# EAGLE design ESR_Harness (EAGLE 5.06)
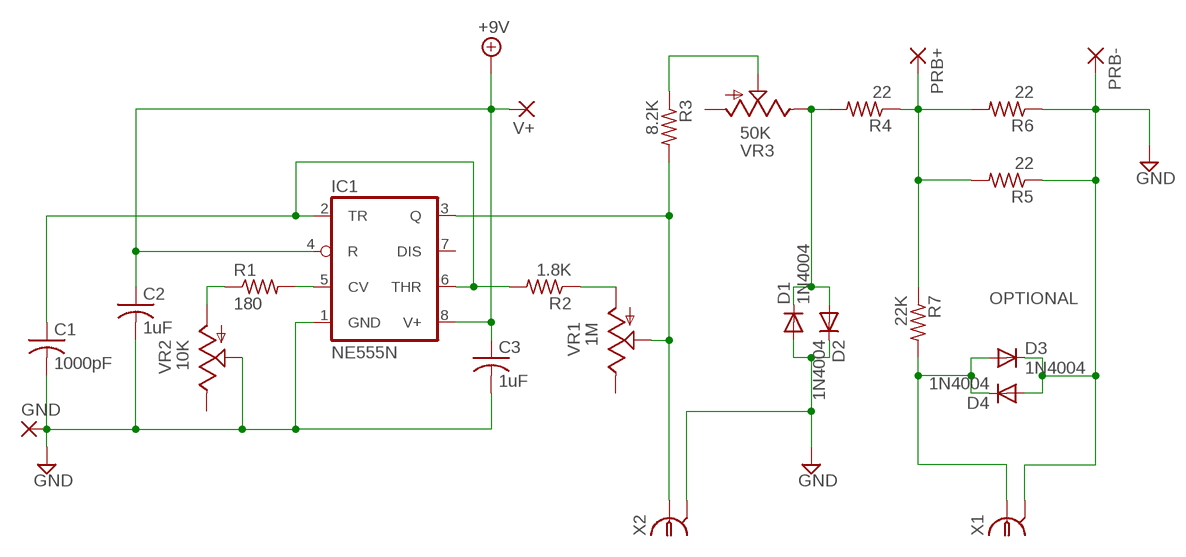
[diagram p0: schematic, sheet 1]

## Parts
C1  1000pF  C-US050-025X075  [C050-025X075]
C2  1uF  C-US050-025X075  [C050-025X075]
C3  1uF  C-US050-025X075  [C050-025X075]
D1  1N4004  [DO41-10]
D2  1N4004  [DO41-10]
D3  1N4004  [DO41-10]
D4  1N4004  [DO41-10]
GND  WIREPAD2,15/1,0  [2,15/1,0]
IC1  NE555N  [DIL08]
PRB+  WIREPAD3,17/1,3  [3,17/1,3]
PRB-  WIREPAD3,17/1,3  [3,17/1,3]
R1  180  R-US_0309/10  [0309/10]
R2  1.8K  R-US_0309/10  [0309/10]
R3  8.2K  R-US_0207/5V  [0207/5V]
R4  22  R-US_0309/12  [0309/12]
R5  22  R-US_0309/12  [0309/12]
R6  22  R-US_0309/12  [0309/12]
R7  22K  R-US_0309/12  [0309/12]
V+  WIREPAD2,15/1,0  [2,15/1,0]
VR1  1M  TRIM_US-  [OFFBOARD_POT_3]
VR2  10K  TRIM_US-  [OFFBOARD_POT_3]
VR3  50K  TRIM_US-  [OFFBOARD_POT_3]
X1  OFFBOARD_BNC  [OFFBOARD_COAX]
X2  OFFBOARD_BNC  [OFFBOARD_COAX]

## Nets
+9V: C2.1 C3.1 IC1.4(R) IC1.8(V+) V+.1(P)
GND: C1.2 C2.2 C3.2 D1.A D2.C D3.C D4.A GND.1(P) IC1.1(GND) PRB-.1(P) R5.1 R6.1 VR2.P$2(S) X1.P$GND(GND) X2.P$GND(GND)
N$1: C1.1 IC1.2(TR) IC1.6(THR) R2.2
N$2: IC1.5(CV) R1.2
N$4: IC1.3(Q) R3.2 VR1.P$2(S) X2.P$1
N$5: PRB+.1(P) R4.1 R5.2 R6.2 R7.1
N$6: R1.1 VR2.P$1(A)
N$7: D1.C D2.A R4.2 VR3.P$3(E)
N$8: R3.1 VR3.P$2(S)
N$9: D3.A D4.C R7.2 X1.P$1
N$10: R2.1 VR1.P$1(A)
Unconnected: IC1.7(DIS) VR1.P$3(E) VR2.P$3(E) VR3.P$1(A)

## Notes on the sheet
- OPTIONAL

## Library data of the parts
C1-C3 = rcl:C-US: CAPACITOR, American symbol
D1-D4 = diode:1N4004: DIODE general purpose rectifier, 1 A
GND PRB+ PRB- V+ = wirepad:WIREPAD: Wire PAD connect wire on PCB
IC1 = linear:*555: TIMER
R1-R7 = rcl:R-US_: RESISTOR, American symbol
VR1-VR3 = mes:TRIM_US-: POTENTIOMETER
X1 X2 = mes:OFFBOARD_BNC: JACK, 50 OHM, BNC

## Board
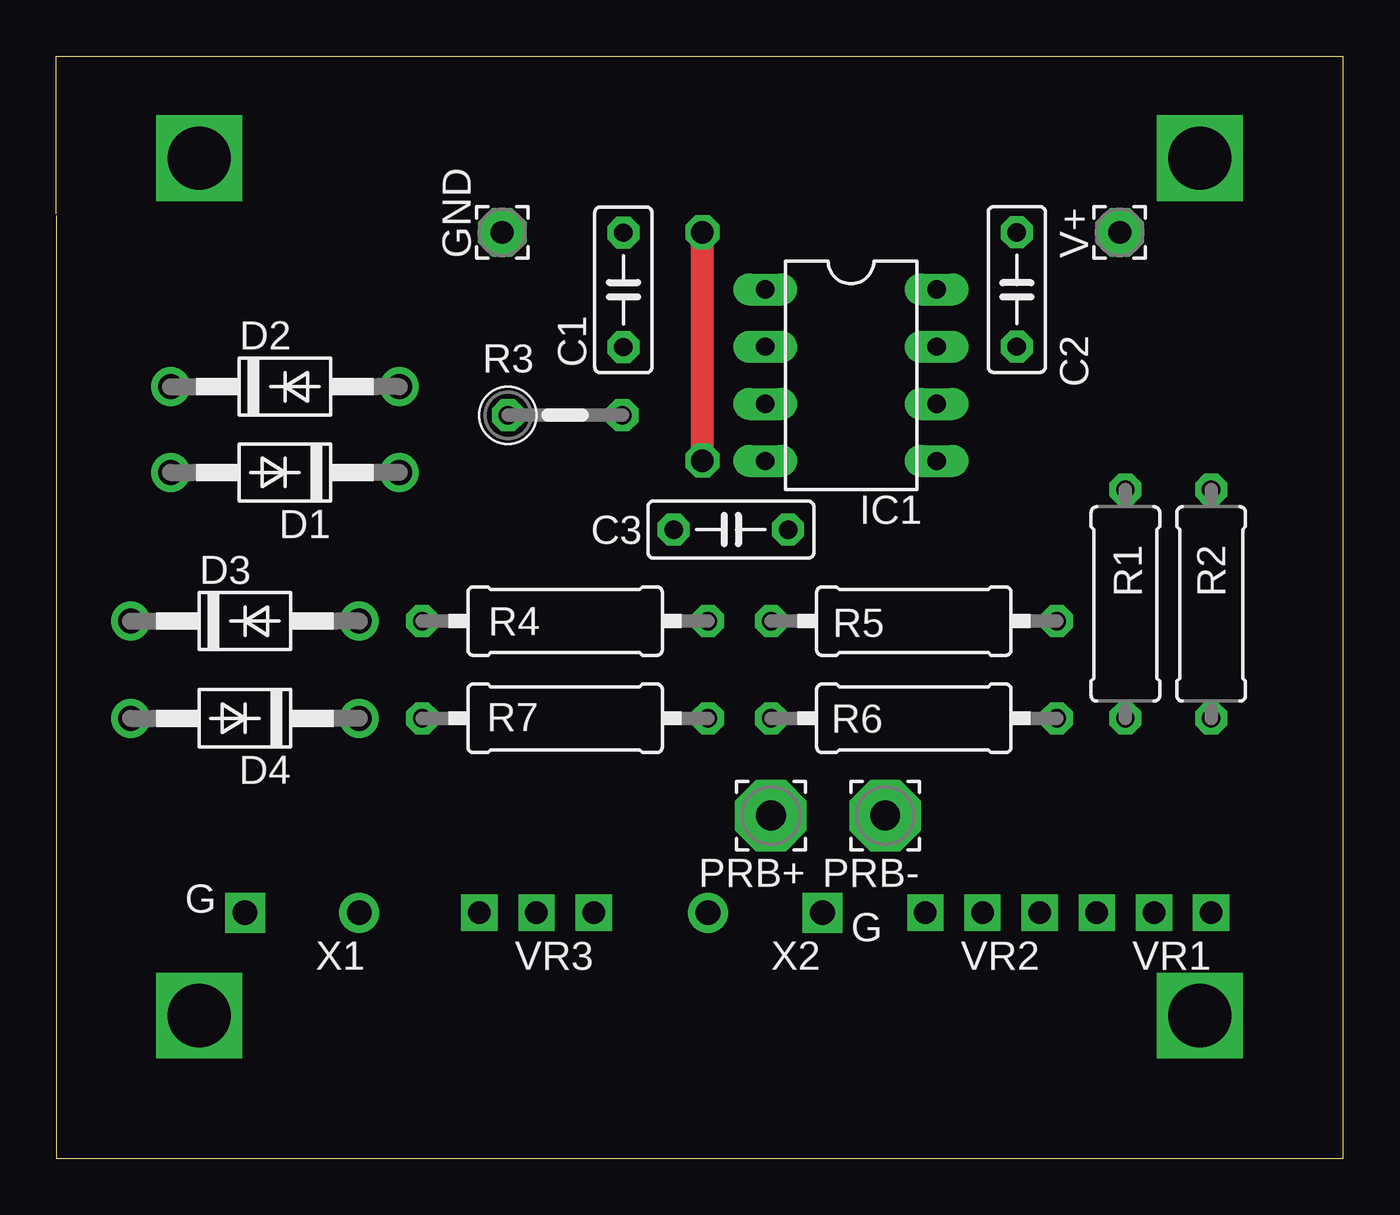
[diagram p1: board, top side]
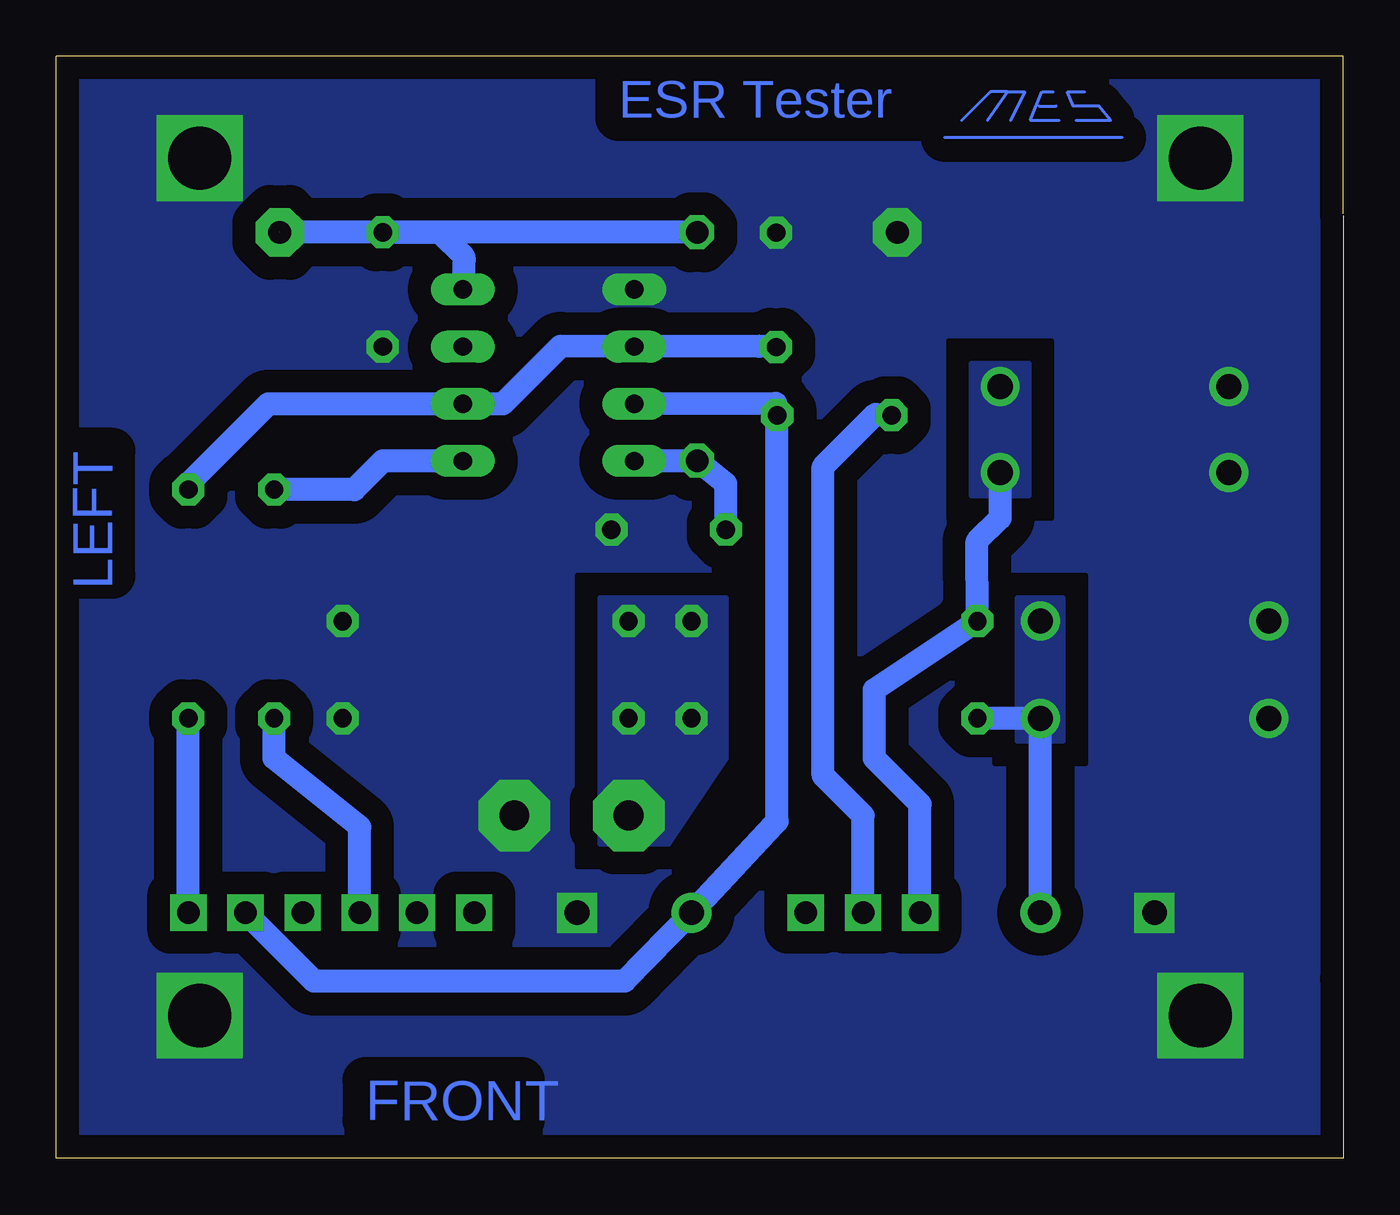
[diagram p2: board, bottom side, seen from below]

Size 57.18 x 48.97 mm. Coordinates in mm from the lower left corner, seen from the top.
Outline: 0,41.89 0,8
Outline: 0,41.99 0,48.97 57.17,48.97 57.17,0 8.03,0
Outline: 0,7.98 0,0 8.03,0
Outline: 8.03,0 8.05,0
Copper layers (1*16): Top 0.035mm / dielectric 1.5mm / Bottom 0.035mm
Design rules "SparkFun": minimum track width 8mil, minimum drill 20mil, track to track 8mil, track to pad 8mil, pad to pad 8mil, via to via 8mil, smd to smd 8mil, copper to edge 10mil, drill to drill 8mil, minimum pad ring 12mil, minimum via ring 10mil, stop-mask expansion 4mil, vias tented up to drill 25mil, thermal gap 10mil

### Footprints (pad centres in the part's own frame; a part is rotated, then mirrored left to right if it is on the bottom)
C050-025X075 = drill 0.813 octagon: 1 -2.54,0; 2 2.54,0
DO41-10 = drill 1.118 round: A 5.08,0; C -5.08,0
2,15/1,0 = drill 1.016 pad 2.159 octagon: 1 0,0
DIL08 = drill 0.813 long: 1 -3.81,-3.81; 2 -1.27,-3.81; 3 1.27,-3.81; 4 3.81,-3.81; 5 3.81,3.81; 6 1.27,3.81; 7 -1.27,3.81; 8 -3.81,3.81
3,17/1,3 = drill 1.321 pad 3.175 octagon: 1 0,0
0309/10 = drill 0.813 octagon: 1 -5.08,0; 2 5.08,0
0207/5V = drill 0.813 octagon: 1 -2.54,0; 2 2.54,0
0309/12 = drill 0.813 octagon: 1 -6.35,0; 2 6.35,0
OFFBOARD_POT_3 = drill 1 square: P$1 -2.54,0; P$2 0,0; P$3 2.54,0
OFFBOARD_COAX = drill 1.1 pad 1.778 round: P$1 -2.54,0 | drill 1.1 pad 1.778 square: P$GND 2.54,0

### Placement (x,y rotation side)
C1  25.19,38.59 90 top
C2  42.67,38.61 270 top
C3  29.97,27.94 0 top
D1  10.16,30.48 180 top
D2  10.16,34.29 0 top
D3  8.38,23.88 0 top
D4  8.38,19.56 180 top
GND  19.81,41.15 90 top
IC1  35.31,34.8 270 top
PRB+  31.75,15.24 180 top
PRB-  36.83,15.24 180 top
R1  47.5,24.64 90 top
R2  51.31,24.64 90 top
R3  22.61,33.02 0 top
R4  22.61,23.88 180 top
R5  38.1,23.88 180 top
R6  38.1,19.56 180 top
R7  22.61,19.56 180 top
U$1  [LOGO]  13.01,46.37 0 top
V+  47.24,41.15 90 top
VR1  48.77,10.92 180 top
VR2  41.15,10.92 180 top
VR3  21.34,10.92 180 top
X1  10.92,10.92 180 top
X2  31.5,10.92 0 top

### Tracks (layer width: path | path; a pad name or v marks a point on that pad's centre or on a via)
+9V  (via drill 1)  (1 unrouted)
  Top 1.016: v28.7,31 v28.7,41.15
  Bottom 1.016: v28.7,31 IC1.4 28.72,31 27.43,29.97 C3.1 27.37,27.94 | v28.7,41.15 C2.1 | C2.1 47.24,41.16 | IC1.8 39.07,40.06 40.17,41.16 C2.1
GND  (via drill 2.8)
  other vias: 6.35,44.45 50.8,6.35 6.35,6.35 50.8,44.45
  pour Bottom (isolate 1.016, rank 5, no thermals): 0.27,48.75 57.01,48.75 57.01,0 0.27,0
N$1
  Bottom 1.016: IC1.2 31.43,36.07 | IC1.2 34.78,36.08 37.34,33.53 IC1.6 47.75,33.53 51.31,29.97 R2.2 | IC1.2 25.96,36.08 C1.1
N$2
  Bottom 1.016: 39.08,30.99 IC1.5 42.67,30.99 43.94,29.72 R1.2
N$4
  Bottom 1.016: 31.33,33.42 IC1.3 25.22,33.54 R3.2 | VR1.P$2 45.72,7.87 31.92,7.87 X2.P$1 25.32,14.81 25.15,14.99 R3.2 | R3.2 25.15,33.38
N$5
  pour Bottom (no thermals): 27.43,24.89 33.02,24.89 33.02,13.97 29.97,13.97 27.43,17.78
N$6
  Bottom 1.016: VR2.P$1 43.69,14.73 47.5,17.78 R1.1
N$7
  Bottom 1.016: VR3.P$3 18.8,15.75 20.83,17.78 20.83,20.83 R4.2 16.26,27.42 15.24,28.45 D1.C
  pour Bottom (no thermals): 13.97,35.31 16.51,35.31 16.51,29.46 13.97,29.46
N$8
  Bottom 1.016: VR3.P$2 21.34,15.24 23.11,17.02 23.11,30.73 20.78,33.07 R3.1
N$9
  Bottom 1.016: X1.P$1 D4.C R7.2
  pour Bottom (no thermals): 12.45,24.89 12.45,18.54 14.48,18.54 14.48,24.89
N$10
  Bottom 1.016: VR1.P$1 R2.1

### Text on the board
Bottom: ESR Tester | LEFT | FRONT